# EAGLE design power proto routed (EAGLE 7.4.0)
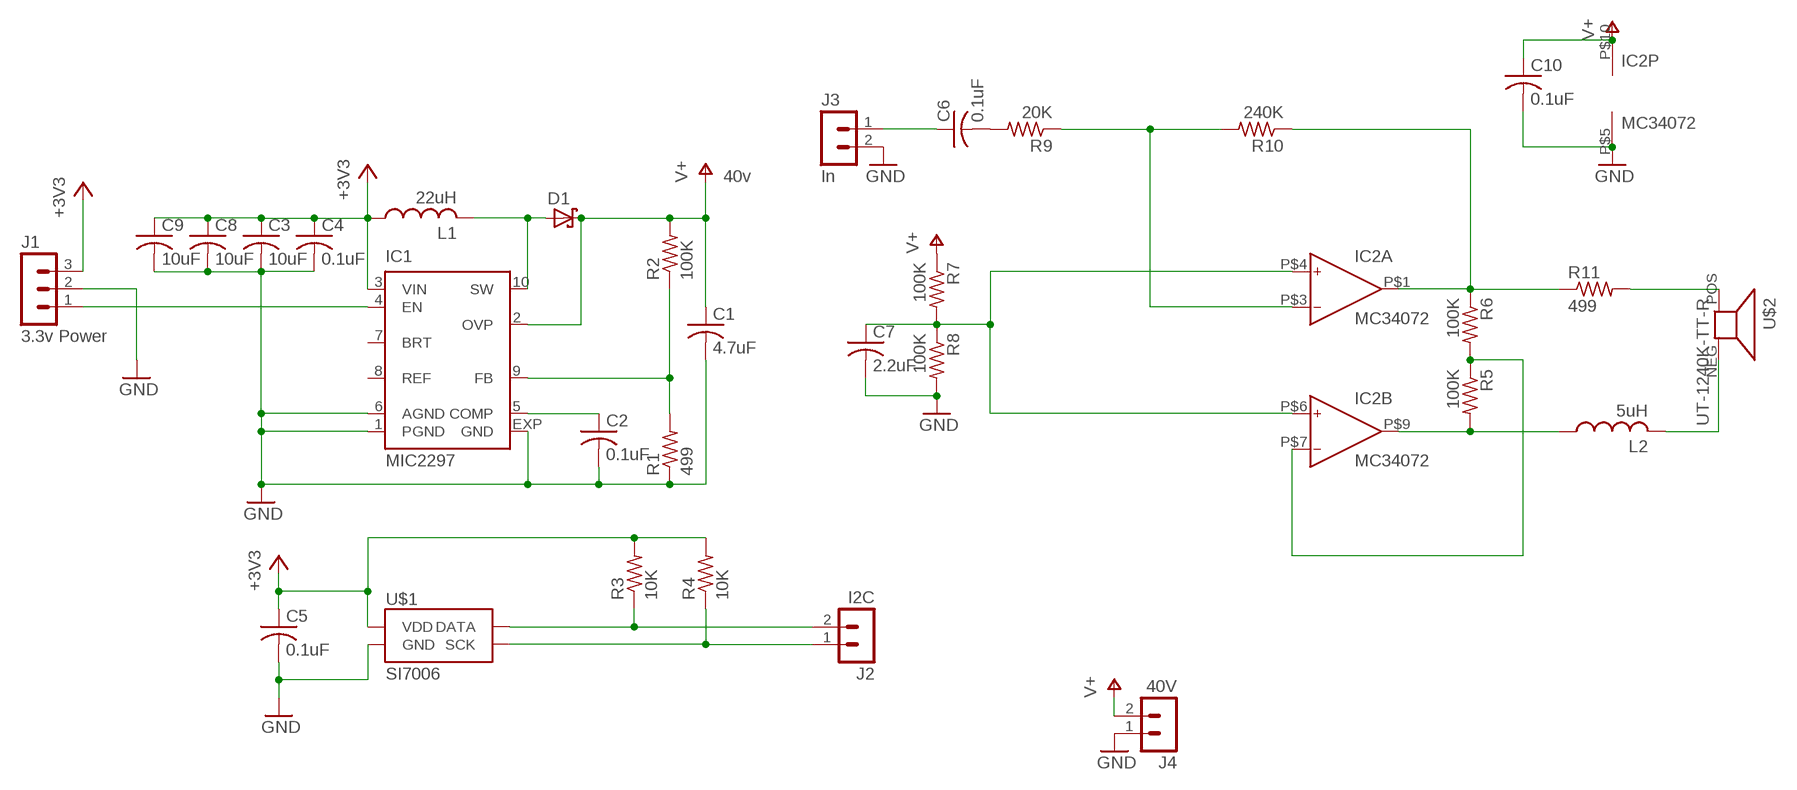
[diagram p0: schematic, sheet 1]

## Parts
C1  4.7uF  C-USC0805  [C0805]
C2  0.1uF  C-USC0805  [C0805]
C3  10uF  C-USC0805  [C0805]
C4  0.1uF  C-USC0805  [C0805]
C5  0.1uF  C-USC0805  [C0805]
C6  0.1uF  C-USC0805  [C0805]
C7  2.2uF  C-USC0805  [C0805]
C8  10uF  C-USC0805  [C0805]
C9  10uF  C-USC0805  [C0805]
C10  0.1uF  C-USC0805  [C0805]
D1  DIODE_SCHOTTKYMICROSMP  [DIODE_SCHOTTKY_MICROSMP]
IC1  MIC2297  [MLF10]
IC2  MC34072  [WQFN10]
J1  3.3v Power  MA03-1  [MA03-1]
J2  I2C  MA02-1  [MA02-1]
J3  In  MA02-1  [MA02-1]
J4  40V  MA02-1  [MA02-1]
L1  22uH  INDUCTOR7  [INDUCTOR_BOURNS_SRN3012TA]
L2  5uH  INDUCTOR  [INDUCTOR_BOURNS_SDR0503]
R1  499  R-US_R0805  [R0805]
R2  100K  R-US_R0805  [R0805]
R3  10K  R-US_R0805  [R0805]
R4  10K  R-US_R0805  [R0805]
R5  100K  R-US_R0805  [R0805]
R6  100K  R-US_R0805  [R0805]
R7  100K  R-US_R0805  [R0805]
R8  100K  R-US_R0805  [R0805]
R9  20K  R-US_R0805  [R0805]
R10  240K  R-US_R0805  [R0805]
R11  499  R-US_R0805  [R0805]
U$1  SI7006  [SI7006]
U$2  UT-1240K-TT-R  [UT-1240K-TT-R]

## Nets
+3V3: C3.1 C4.1 C5.1 C8.1 C9.1 IC1.3(VIN) J1.3 L1.P$1 R3.2 R4.2 U$1.VDD
GND: C1.2 C2.2 C3.2 C4.2 C5.2 C7.2 C8.2 C9.2 C10.2 IC1.1(PGND) IC1.6(AGND) IC1.EXP(GND) IC2.P$5(P:V-) J1.2 J3.2 J4.1 R1.1 R8.2 U$1.GND
N$1: IC1.4(EN) J1.1
N$2: D1.A IC1.10(SW) L1.P$2
N$3: J2.1 R4.1 U$1.SCK
N$4: J2.2 R3.1 U$1.DATA
N$5: C2.1 IC1.5(COMP)
N$6: IC2.P$9(B:OUT) L2.1 R5.2
N$7: IC2.P$7(B:IN-) R5.1 R6.2
N$8: IC2.P$1(A:OUT) R6.1 R10.1 R11.1
N$9: IC1.9(FB) R1.2 R2.1
N$10: R11.2 U$2.POS
N$11: C7.1 IC2.P$4(A:IN+) IC2.P$6(B:IN+) R7.2 R8.1
N$12: IC2.P$3(A:IN-) R9.1 R10.2
N$13: C6.2 R9.2
N$14: L2.2 U$2.NEG
N$15: C6.1 J3.1
V+: C1.1 C10.1 D1.C IC1.2(OVP) IC2.P$10(P:V+) J4.2 R2.2 R7.1
Unconnected: IC1.7(BRT) IC1.8(REF)

## Notes on the sheet
- 40v

## Library data of the parts
C1-C10 = rcl:C-US: CAPACITOR, American symbol
D1 = filip:DIODE_SCHOTTKY: Schottky Power Rectifier
IC1 = micrel:MIC2297: 40V PWM Boost Regulator White LED Driver Source: http://www.micrel.com/_PDF/mic2297.pdf; MPN: MIC2297-38YML TR; OC_FARNELL: 1663107; OC_NEWARK: 11R3489
IC2 = filip:MC34072: Dual Precision, Low Cost, High Speed Op Amp +44v supply
J1 = filip:MA03-1: PIN HEADER; OC_FARNELL: unknown; OC_NEWARK: unknown
J2-J4 = filip:MA02-1
L1 L2 = filip:INDUCTOR
R1-R11 = rcl:R-US_: RESISTOR, American symbol
U$1 = filip:SI7006: The Si7006 is an I2C Humidity and Temperature Sensor; PROD_ID: IC-13093
U$2 = filip:UT-1240K-TT-R

## Board
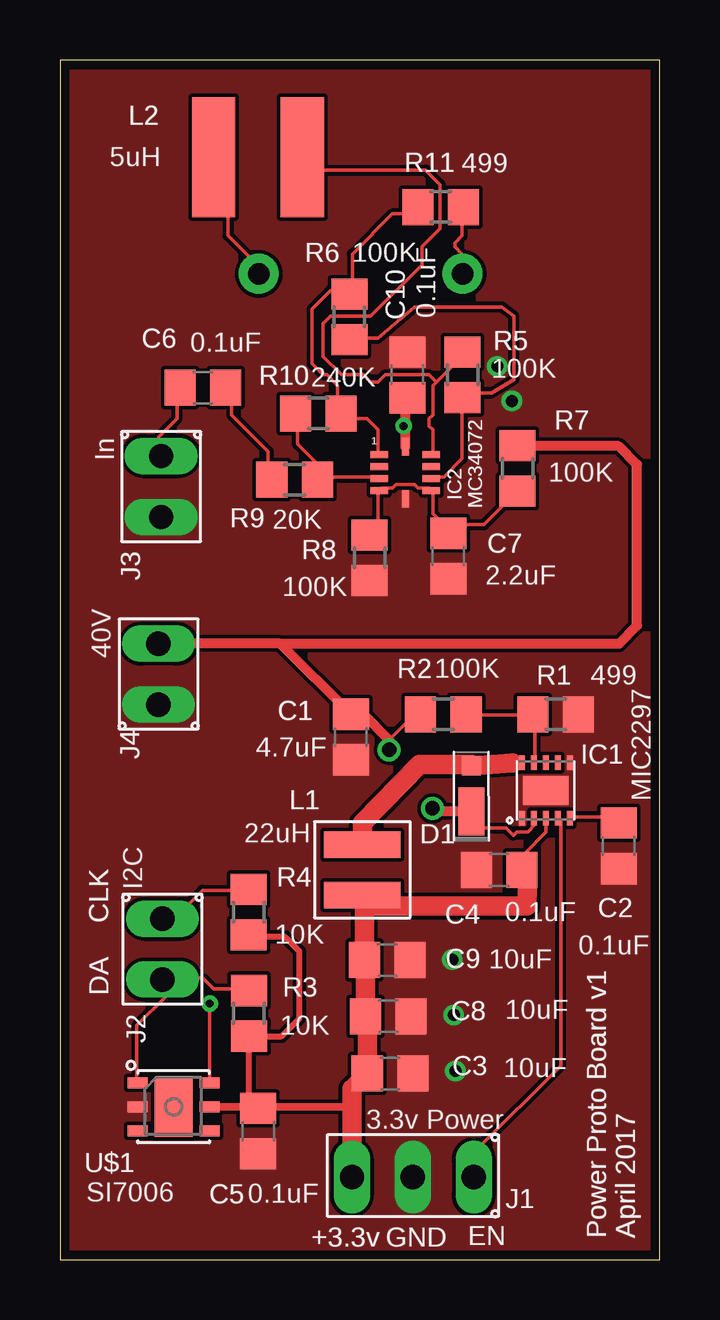
[diagram p1: board, top side]
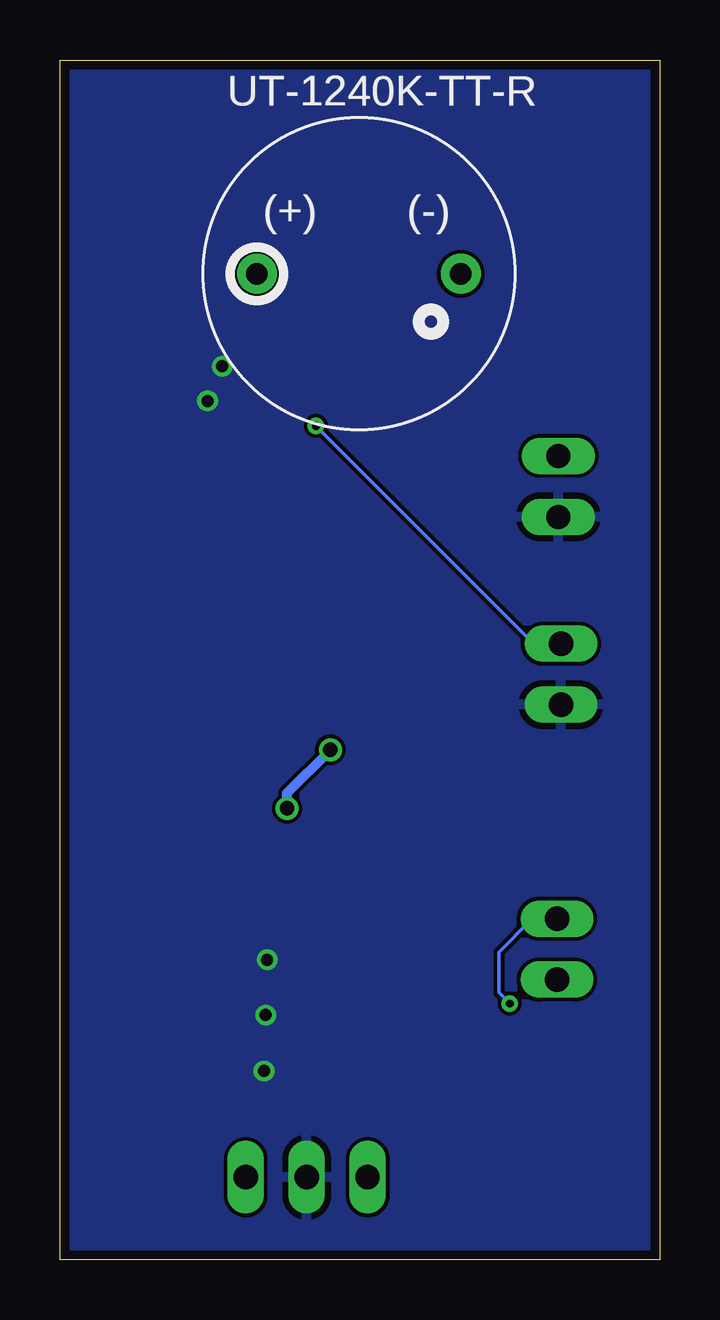
[diagram p2: board, bottom side, seen from below]

Size 25 x 50 mm. Coordinates in mm from the lower left corner, seen from the top.
Outline: 0,0 25,0 25,50 0,50 0,0
Copper layers (1*16): Top 0.0356mm / dielectric 1.5011mm / Bottom 0.0356mm
Design rules "OSH Parks LaenPCBOrder": minimum track width 6mil, minimum drill 13mil, track to track 6mil, track to pad 6mil, pad to pad 6mil, via to via 6mil, smd to smd 6mil, copper to edge 15mil, drill to drill 6mil, minimum pad ring 7mil, minimum via ring 7mil, stop-mask expansion 3mil, vias tented up to drill 0mil, thermal gap 10mil

### Footprints (pad centres in the part's own frame; a part is rotated, then mirrored left to right if it is on the bottom)
C0805 = smd 1.3 x 1.5: 1 -0.95,0; 2 0.95,0
DIODE_SCHOTTKY_MICROSMP = smd 0.8 x 0.8: A 0.4,0 | smd 2 x 1.1: C -1.5,0
MLF10 = smd 0.6 x 0.25: 1 -1.15,1; 2 -1.15,0.5; 3 -1.15,0; 4 -1.15,-0.5; 5 -1.15,-1; 6 1.15,-1; 7 1.15,-0.5; 8 1.15,0; 9 1.15,0.5; 10 1.15,1 | smd 1.2 x 1.9: EXP 0,0
WQFN10 = smd 0.73 x 0.3: P$1 -1.085,0.75; P$2 -1.085,0.25; P$3 -1.085,-0.25; P$4 -1.085,-0.75; P$6 1.085,-0.75; P$7 1.085,-0.25; P$8 1.085,0.25; P$9 1.085,0.75 | smd 0.3 x 0.73: P$5 0,-1.085; P$10 0,1.085
MA03-1 = drill 1.016 long: 1 -2.54,0; 2 0,0; 3 2.54,0
MA02-1 = drill 1.016 long: 1 -2.54,0; 2 0,0
INDUCTOR_BOURNS_SRN3012TA = smd 1.1 x 3.2: P$1 -1.05,0; P$2 1.05,0
INDUCTOR_BOURNS_SDR0503 = smd 1.8 x 5: 1 -1.85,0; 2 1.85,0
R0805 = smd 1.3 x 1.5: 1 -0.95,0; 2 0.95,0
SI7006 = smd 0.85 x 0.45: DATA 1.5,-1; GND 1.5,0; NC@3 1.5,1; NC@4 -1.5,1; SCK -1.5,-1; VDD -1.5,0 | smd 1.6 x 2.5: P$1 0,0
UT-1240K-TT-R = drill 0.9 pad 1.676: NEG 4.25,0; POS -4.25,0

### Placement (x,y rotation side)
C1  12.13,21.78 270 top
C2  23.3,17.24 270 top
C3  13.76,7.75 0 top
C4  18.32,16.24 180 top
C5  8.27,5.36 270 top
C6  5.96,36.34 0 top
C7  16.19,29.32 270 top
C8  13.69,10.15 0 top
C9  13.65,12.48 0 top
C10  14.48,36.87 90 top
D1  17.16,20.18 90 top
IC1  20.26,19.55 90 top
IC2  14.4,32.8 0 top
J1  14.71,3.44 180 top
J2  4.28,11.67 270 top
J3  4.22,30.95 270 top
J4  4.11,25.67 90 top
L1  12.61,16.24 90 top
L2  8.25,45.96 180 top
R1  20.67,22.72 180 top
R2  15.99,22.72 180 top
R3  7.88,10.26 270 top
R4  7.87,14.48 270 top
R5  16.79,36.88 90 top
R6  12.06,39.29 270 top
R7  19.08,32.98 270 top
R8  12.92,29.25 270 top
R9  9.78,32.5 180 top
R10  10.77,35.27 180 top
R11  15.88,43.87 0 top
U$1  4.74,6.36 180 top
U$2  12.53,41.09 0 bottom

### Tracks (layer width: path | path; a pad name or v marks a point on that pad's centre or on a via)
+3V3
  Top 0.152: IC1.3 20.27,18.29 20.27,17.83 19.36,16.92 19.36,16.61 C4.1
  Top 0.254: 8.27,6.36 7.88,6.36 R3.2 9.24,9.31 9.98,10.05 9.98,12.84 9.38,13.45 7.95,13.45 R4.2
  Top 0.305: U$1.VDD 8.27,6.36 | 8.27,6.36 C5.1 | 8.27,6.36 12.18,6.36 12.18,6.57
  Top 0.813: C4.1 19.25,16.23 19.49,15.51 19.48,14.73 13.07,14.73 L1.P$1 12.7,15.1 C9.1 12.74,12.44 C8.1 12.81,10.07 C3.1 12.18,7.11 12.18,6.57 J1.3
GND  (via drill 0.5)
  other vias: 18.24,37.24 18.84,35.79 16.49,7.86 16.43,10.19 16.36,12.5
  pour Bottom: 0.1,0 24.9,0 24.9,50 0.4,50 0.4,0.5
  pour Top (no thermals): 24.7,0.3 24.8,0.3 24.8,49.6 0.5,49.6 0.5,0.4 21.8,0.4 21.8,0.1
N$1
  Top 0.152: IC1.4 20.88,18.29 20.88,8.08 17.37,4.57 17.37,3.5 J1.1
N$2
  Top 0.254: IC1.10 18.87,20.7
  Top 0.813: L1.P$2 12.61,18.19 15,20.64 17.16,20.64 D1.A 18.87,20.7
N$3  (via drill 0.33)
  Top 0.152: v6.25,10.67 6.25,7.47 U$1.SCK | R4.1 7.77,15.39 5.94,15.39 4.88,14.33 4.42,14.33 J2.1
  Bottom 0.152: v6.25,10.67 6.71,11.12 6.71,12.8 5.33,14.17 4.42,14.17 J2.1
N$4
  Top 0.152: U$1.DATA 3.2,7.47 3.2,9.75 4.42,10.97 4.42,11.58 J2.2 4.42,11.73 5.94,11.73 6.4,11.28 7.77,11.28 R3.1
N$5
  Top 0.152: IC1.5 21.34,18.44 23.01,18.44 23.16,18.29 C2.1
N$6
  Top 0.152: 15.7,36.58 16.92,37.8 R5.2 | 15.7,36.58 15.54,36.42 15.54,35.2 15.39,35.05 15.39,34.75 15.54,34.59 15.54,33.68 IC2.P$9 | 15.7,36.58 15.39,36.88 13.56,36.88 13.26,36.58 12.95,36.58 12.65,36.88 11.73,36.88 10.97,37.64 10.97,39.01 11.28,39.32 12.95,39.32 15.09,41.45 15.09,42.22 15.85,42.98 15.85,44.81 15.24,45.41 10.67,45.41 10.21,45.87 L2.1
N$7
  Top 0.152: IC2.P$7 15.54,32.61 16,32.61 16.76,33.38 16.76,35.81 R5.1 16.92,35.97 17.07,36.12 17.98,36.12 18.94,36.69 18.92,39.33 18.44,39.7 14.78,39.7 13.26,38.41 12.19,38.41 R6.2
N$8
  Top 0.152: IC2.P$1 13.26,33.68 13.26,34.59 12.8,35.05 11.89,35.05 11.73,35.2 R10.1 11.58,35.36 11.58,36.42 11.12,36.88 10.97,36.88 10.52,37.34 10.52,39.62 11.28,40.39 12.04,40.39 R6.1 12.19,40.39 12.19,41.91 13.87,43.59 14.63,43.59 14.78,43.74 R11.1
N$9
  Top 0.152: IC1.9 19.81,20.73 19.81,22.71 R1.2 19.66,22.71 17.07,22.71 R2.1
N$10
  Top 0.152: R11.2 16.76,43.74 16.76,42.67 16.46,42.37 16.46,42.22 16.76,41.91 16.76,41.15 U$2.POS
N$11
  Top 0.152: R8.1 12.95,30.33 13.26,30.63 13.26,32 IC2.P$4 13.41,32.16 13.87,32.16 14.02,32.31 14.78,32.31 14.94,32.16 15.39,32.16 IC2.P$6 15.54,32 15.54,31.09 16.31,30.33 | 16.31,30.33 16.61,30.63 17.68,30.63 19.05,32 R7.2 | 16.31,30.33 C7.1
N$12
  Top 0.152: IC2.P$3 13.26,32.61 10.82,32.61 R9.1 10.67,32.61 10.67,33.22 9.91,33.98 9.91,35.2 R10.2
N$13
  Top 0.152: R9.2 8.69,32.61 8.69,33.68 7.16,35.2 7.16,36.12 7.01,36.27 C6.2
N$14
  Top 0.152: U$2.NEG 8.23,41.15 8.23,41.45 7.01,42.67 7.01,45.41 6.55,45.87 L2.2
N$15
  Top 0.152: C6.1 4.88,36.27 4.88,35.05 4.12,34.29 4.12,33.53 J3.1
V+  (via drill 0.33, 0.6)
  Top 0.152: IC1.2 19.81,18.29 19.81,18.14 19.51,17.83 19.05,17.83 18.9,17.68 18.59,17.98 17.68,17.98 17.07,18.59 D1.C | 13.73,21.66 13.87,21.79 14.94,22.86 R2.2 | v14.33,34.75 14.4,34.75
  Top 0.406: 15.03,22.73 R2.2 | D1.C 15.66,18.68 v15.53,18.81 | v13.73,21.25 13.73,21.66 12.65,22.73 C1.1 9.19,25.67 | 9.19,25.67 J4.2 | 9.19,25.67 23.32,25.67 24.06,26.42 24.06,33.14 23.3,33.9 18.89,33.9 R7.1 | IC2.P$10 14.4,34.75 14.4,35.84 C10.1
  Bottom 0.152: v14.33,34.75 5.33,25.76 4.12,25.76 J4.2
  Bottom 0.406: v15.53,18.81 15.53,19.44 v13.73,21.25

### Text on the board
tNames: CLK | DA | +3.3v | GND | EN | Power Proto Board v1 / April 2017
_tsilk: L2 | 5uH | R11 | 499 | R6 | 100K | C10 | 0.1uF | R5 | C6 | 0.1uF | 100K | R10 | 240K | R7 | In | 1 | IC2 | 100K | R9 | 20K | MC34072 | J3 | R8 | C7 | 100K | 2.2uF | 40V | R2 | 100K | R1 | 499 | MIC2297 | C1 | J4 | 4.7uF | IC1 | L1 | 22uH | I2C | D1 | R4 | C4 | CLK | 0.1uF | C2 | 10K | 0.1uF | C9 | 10uF | DA | R3 | J2 | C8 | 10uF | 10K | C3 | 10uF | 3.3v Power | U$1 | SI7006 | J1 | C5 | 0.1uF | +3.3v | GND | EN | Power Proto Board v1 / April 2017
_bsilk: UT-1240K-TT-R | (-) | (+)